# Altium schematic sheet MODULE_FPGA_V2.SchDoc
size A; SheetNumber: 3; SheetTotal: 3
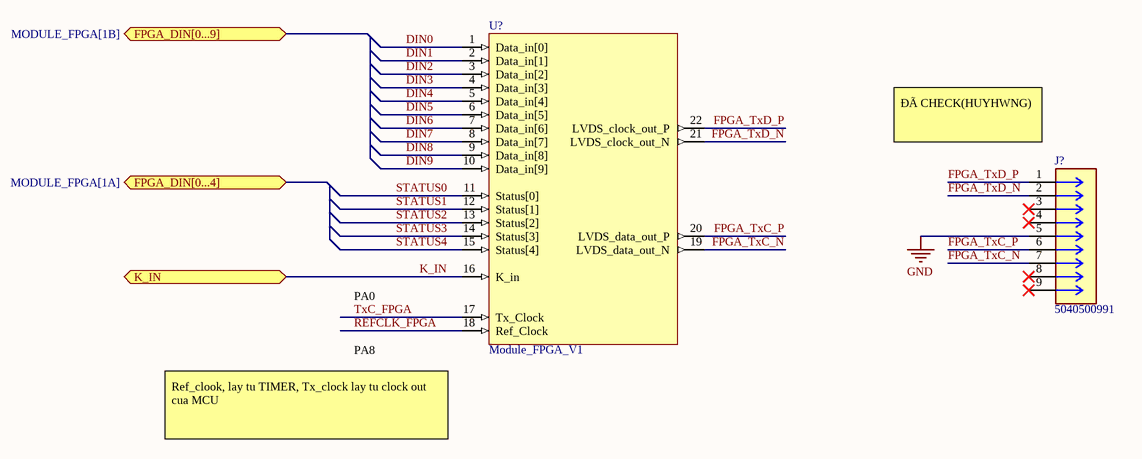
[diagram p0: MODULE_FPGA_V2.SchDoc]

## Parts
J?  5040500991  [5040500991]
U?  Module_FPGA_V1

## Ports
FPGA_DIN[0...4] (bidir, see MODULE_FPGA[1A]), FPGA_DIN[0...9] (bidir, see MODULE_FPGA[1B]), K_IN (bidir)

## Nets
GND: J?.5
DIN0: U?.1(Data_in[0])
DIN1: U?.2(Data_in[1])
DIN2: U?.3(Data_in[2])
DIN3: U?.4(Data_in[3])
DIN4: U?.5(Data_in[4])
DIN5: U?.6(Data_in[5])
DIN6: U?.7(Data_in[6])
DIN7: U?.8(Data_in[7])
DIN8: U?.9(Data_in[8])
DIN9: U?.10(Data_in[9])
FPGA_TxC_N: J?.7 U?.19(LVDS_data_out_N)
FPGA_TxC_P: J?.6 U?.20(LVDS_data_out_P)
FPGA_TxD_N: J?.2 U?.21(LVDS_clock_out_N)
FPGA_TxD_P: J?.1 U?.22(LVDS_clock_out_P)
K_IN: U?.16(K_in) ; port K_IN
REFCLK_FPGA: U?.18(Ref_Clock)
STATUS0: U?.11(Status[0])
STATUS1: U?.12(Status[1])
STATUS2: U?.13(Status[2])
STATUS3: U?.14(Status[3])
STATUS4: U?.15(Status[4])
TxC_FPGA: U?.17(Tx_Clock)

Not connected (* = marked no-connect by the designer): J? 3* 4* 8* 9*

## Notes on the sheet
- (near J?) ĐÃ CHECK(HUYHWNG)
- PA0
- PA8
- Ref_clook, lay tu TIMER, Tx_clock lay tu clock out cua MCU

## Library data of the parts
J? = 5040500991: Connector Header Surface Mount, Right Angle 9 position 0.059" (1.50mm)